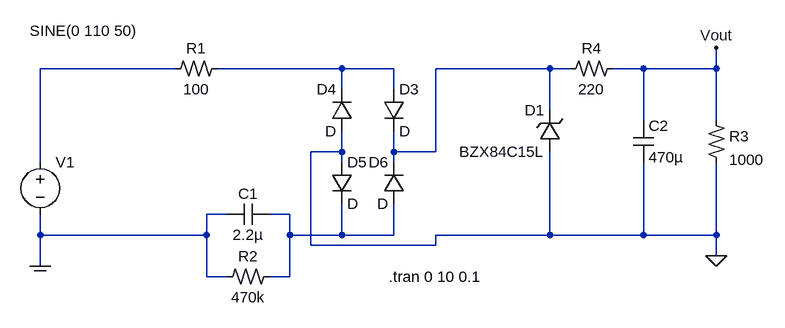
[diagram p0: schematic Capacitive Transformerless.asc]
Capacitive Transformerless.asc, the LTspice schematic file:
Version 4
SHEET 1 1252 680
WIRE 336 160 128 160
WIRE 592 160 400 160
WIRE 672 160 592 160
WIRE 912 160 736 160
WIRE 944 160 912 160
WIRE 1056 160 1008 160
WIRE 1168 160 1168 128
WIRE 1168 160 1056 160
WIRE 592 192 592 160
WIRE 672 192 672 160
WIRE 912 224 912 160
WIRE 1056 240 1056 160
WIRE 1168 240 1168 160
WIRE 592 288 592 256
WIRE 592 288 544 288
WIRE 672 288 672 256
WIRE 736 288 736 160
WIRE 736 288 672 288
WIRE 128 304 128 160
WIRE 592 304 592 288
WIRE 672 304 672 288
WIRE 416 384 384 384
WIRE 512 384 480 384
WIRE 128 416 128 384
WIRE 384 416 384 384
WIRE 384 416 128 416
WIRE 512 416 512 384
WIRE 592 416 592 368
WIRE 592 416 512 416
WIRE 672 416 672 368
WIRE 672 416 592 416
WIRE 912 416 912 288
WIRE 912 416 736 416
WIRE 1056 416 1056 304
WIRE 1056 416 912 416
WIRE 1168 416 1168 304
WIRE 1168 416 1056 416
WIRE 544 432 544 288
WIRE 736 432 736 416
WIRE 736 432 544 432
WIRE 1168 448 1168 416
WIRE 128 464 128 416
WIRE 384 480 384 416
WIRE 416 480 384 480
WIRE 512 480 512 416
WIRE 512 480 480 480
FLAG 1168 448 0
FLAG 128 464 COM
FLAG 1168 128 Vout
SYMBOL voltage 128 288 R0
WINDOW 3 -16 -186 Left 2
SYMATTR Value SINE(0 110 50)
SYMATTR InstName V1
SYMBOL res2 480 464 R90
WINDOW 0 0 32 VBottom 2
WINDOW 3 32 32 VTop 2
SYMATTR InstName R2
SYMATTR Value 470k
SYMBOL cap 480 368 R90
WINDOW 0 0 32 VBottom 2
WINDOW 3 32 32 VTop 2
SYMATTR InstName C1
SYMATTR Value 2.2µ
SYMBOL zener 928 288 R180
WINDOW 0 24 64 Left 2
WINDOW 3 24 0 Left 2
SYMATTR InstName D1
SYMATTR Value BZX84C15L
SYMBOL cap 1040 240 R0
SYMATTR InstName C2
SYMATTR Value 470µ
SYMBOL res2 1152 240 R0
SYMATTR InstName R3
SYMATTR Value 1000
SYMBOL diode 656 192 R0
SYMATTR InstName D3
SYMBOL diode 608 256 R180
WINDOW 0 24 64 Left 2
WINDOW 3 24 0 Left 2
SYMATTR InstName D4
SYMBOL diode 576 304 R0
SYMATTR InstName D5
SYMBOL diode 688 368 R180
WINDOW 0 24 64 Left 2
WINDOW 3 24 0 Left 2
SYMATTR InstName D6
SYMBOL res2 400 144 R90
WINDOW 0 0 32 VBottom 2
WINDOW 3 32 32 VTop 2
SYMATTR InstName R1
SYMATTR Value 100
SYMBOL res2 1008 144 R90
WINDOW 0 0 32 VBottom 2
WINDOW 3 32 32 VTop 2
SYMATTR InstName R4
SYMATTR Value 220
TEXT 664 480 Left 2 !.tran 0 10 0.1

The netlist it stands for:
* Capacitive Transformerless.asc
V1 N001 COM SINE(0 110 50)
R2 N004 COM 470k
C1 N004 COM 2.2µ
D1 0 N003 BZX84C15L
C2 Vout 0 470µ
R3 Vout 0 1000
D3 N002 N003 D
D4 0 N002 D
D5 0 N004 D
D6 N004 N003 D
R1 N002 N001 100
R4 Vout N003 220
.model D D
.lib standard.dio
.tran 0 10 0.1
.backanno
.end